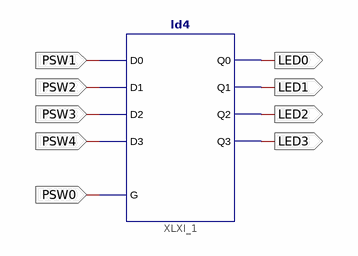
[diagram p0: schematic sheet 1]
// Xilinx ISE schematic lab6_3.sch (spartan3) as structural Verilog: 1 symbols, 9 ports
module lab6_3 (
  input  PSW1,
  input  PSW2,
  input  PSW3,
  input  PSW4,
  input  PSW0,
  output LED0,
  output LED1,
  output LED2,
  output LED3
);

  ld4 XLXI_1 (.D0(PSW1), .D1(PSW2), .D2(PSW3), .D3(PSW4), .G(PSW0), .Q0(LED0), .Q1(LED1), .Q2(LED2), .Q3(LED3));
endmodule
